# Altium schematic sheet 18 BATTERY CHARGER.SchDoc
size 513 x 386 mm
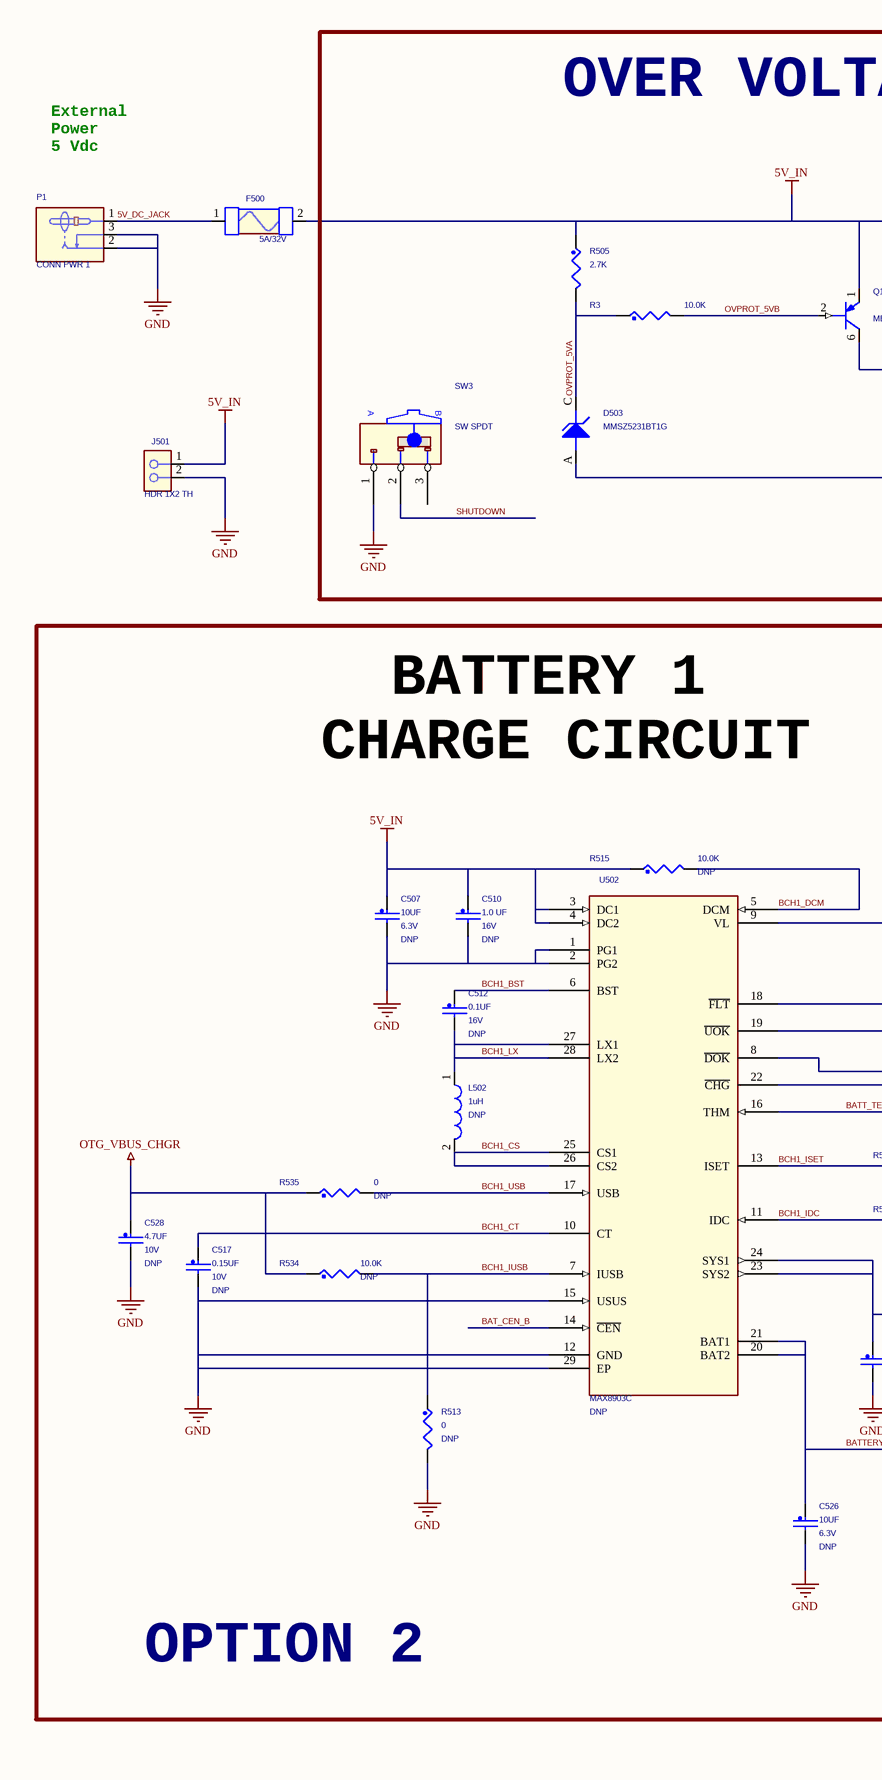
[diagram p0: 18 BATTERY CHARGER.SchDoc, left]
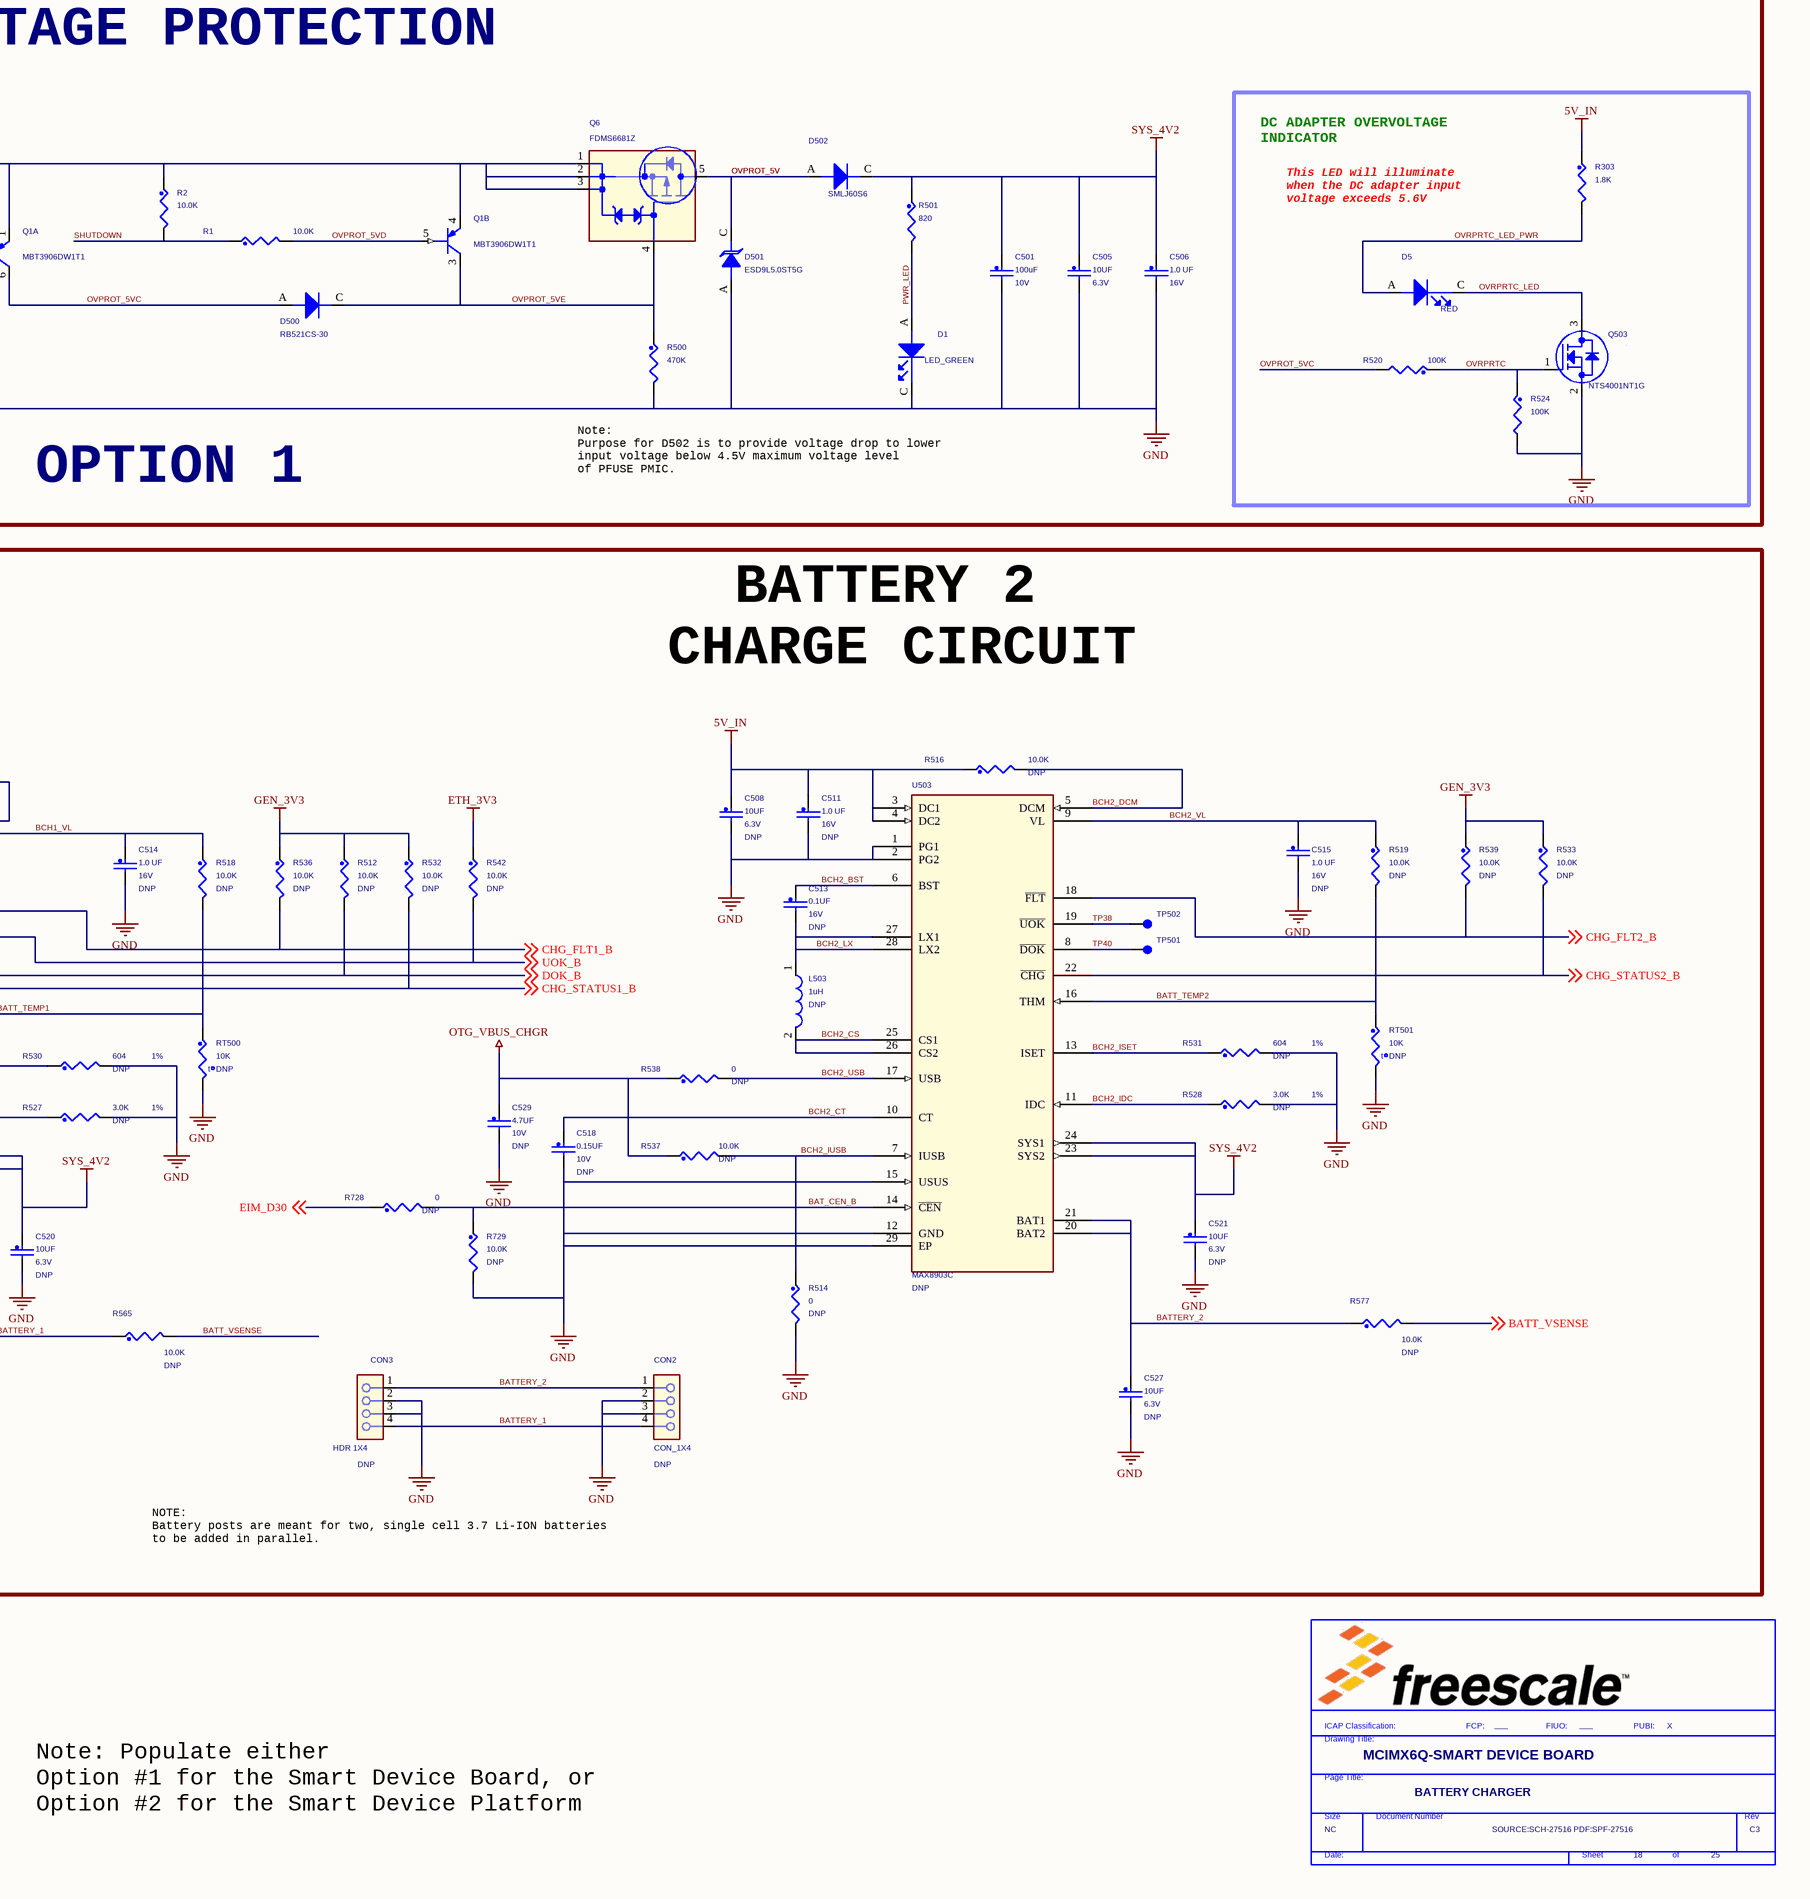
[diagram p1: 18 BATTERY CHARGER.SchDoc, right]

## Parts
*  FIUO: ___  PUBI: X  Doc: SOURCE:SCH-27516 PDF:SPF-27516  RevCode: C3  Title: MCIMX6Q-SMART DEVICE BOARD  Page Size: NC  Page Number: 18  Page Count: 25  PageTitle: BATTERY CHARGER  (hidden comment: TitleBlock_FS)  (graphical)
C501  100uF  WVDC: 10V  [1206_CC]
C505  10UF  WVDC: 6.3V  [0603_CC]
C506  1.0 UF  WVDC: 16V  [0603_CC]
C507  10UF  WVDC: 6.3V  ASSY_OPT: DNP  [0603_CC]
C508  10UF  WVDC: 6.3V  ASSY_OPT: DNP  [0603_CC]
C510  1.0 UF  WVDC: 16V  ASSY_OPT: DNP  [0603_CC]
C511  1.0 UF  WVDC: 16V  ASSY_OPT: DNP  [0603_CC]
C512  0.1UF  WVDC: 16V  ASSY_OPT: DNP  [0402_CC]
C513  0.1UF  WVDC: 16V  ASSY_OPT: DNP  [0402_CC]
C514  1.0 UF  WVDC: 16V  ASSY_OPT: DNP  [0603_CC]
C515  1.0 UF  WVDC: 16V  ASSY_OPT: DNP  [0603_CC]
C517  0.15UF  WVDC: 10V  ASSY_OPT: DNP  [0603_CC]
C518  0.15UF  WVDC: 10V  ASSY_OPT: DNP  [0603_CC]
C520  10UF  WVDC: 6.3V  ASSY_OPT: DNP  [0603_CC]
C521  10UF  WVDC: 6.3V  ASSY_OPT: DNP  [0603_CC]
C526  10UF  WVDC: 6.3V  ASSY_OPT: DNP  [0603_CC]
C527  10UF  WVDC: 6.3V  ASSY_OPT: DNP  [0603_CC]
C528  4.7UF  WVDC: 10V  ASSY_OPT: DNP  [0603_CC]
C529  4.7UF  WVDC: 10V  ASSY_OPT: DNP  [0603_CC]
CON2  CON_1X4  ASSY_OPT: DNP  [con_tb_4f_2p5_9x10p5]
CON3  HDR 1X4  ASSY_OPT: DNP  [HDR104]
D1  LED_GREEN  [LED_0603]
D5  RED  [LED_0603]
D500  RB521CS-30  [do_vmn2]
D501  ESD9L5.0ST5G  [sod-923]
D502  SMLJ60S6  [do214ab_sm]
D503  MMSZ5231BT1G  [sod123]
F500  5A/32V  [fuse_3p4x1p8]
J501  HDR 1X2 TH  [HDR102]
L502  1uH  ASSY_OPT: DNP  [ind_vls252010]
L503  1uH  ASSY_OPT: DNP  [ind_vls252010]
P1  CONN PWR 1  [PJ-202B]
Q1  MBT3906DW1T1  [sot363]  (parts A,B of 2)
Q6  FDMS6681Z  [POWER56]
Q503  NTS4001NT1G  [sc70_3]
R1  10.0K  [0402_CC]
R2  10.0K  [0402_CC]
R3  10.0K  [0402_CC]
R303  1.8K  [0402_CC]
R500  470K  [0603_CC]
R501  820  [0402_CC]
R505  2.7K  [0603_CC]
R512  10.0K  ASSY_OPT: DNP  [0402_CC]
R513  0  ASSY_OPT: DNP  [0402_CC]
R514  0  ASSY_OPT: DNP  [0402_CC]
R515  10.0K  ASSY_OPT: DNP  [0402_CC]
R516  10.0K  ASSY_OPT: DNP  [0402_CC]
R518  10.0K  ASSY_OPT: DNP  [0402_CC]
R519  10.0K  ASSY_OPT: DNP  [0402_CC]
R520  100K  [0402_CC]
R524  100K  [0402_CC]
R527  3.0K  Tolerance: 1%  ASSY_OPT: DNP  [0603_CC]
R528  3.0K  Tolerance: 1%  ASSY_OPT: DNP  [0603_CC]
R530  604  ASSY_OPT: DNP  Tolerance: 1%  [0603_CC]
R531  604  Tolerance: 1%  ASSY_OPT: DNP  [0603_CC]
R532  10.0K  ASSY_OPT: DNP  [0402_CC]
R533  10.0K  ASSY_OPT: DNP  [0402_CC]
R534  10.0K  ASSY_OPT: DNP  [0402_CC]
R535  0  ASSY_OPT: DNP  [0402_CC]
R536  10.0K  ASSY_OPT: DNP  [0402_CC]
R537  10.0K  ASSY_OPT: DNP  [0402_CC]
R538  0  ASSY_OPT: DNP  [0402_CC]
R539  10.0K  ASSY_OPT: DNP  [0402_CC]
R542  10.0K  ASSY_OPT: DNP  [0402_CC]
R565  10.0K  ASSY_OPT: DNP  [0402_CC]
R577  10.0K  ASSY_OPT: DNP  [0402_CC]
R728  0  ASSY_OPT: DNP  [0402_CC]
R729  10.0K  ASSY_OPT: DNP  [0402_CC]
RT500  10K  ASSY_OPT: DNP  [0603_CC]
RT501  10K  ASSY_OPT: DNP  [0603_CC]
SW3  SW SPDT  [sw_spdt_ra]
TP501  TEST POINT  [C035S]  (value not drawn)
TP502  TEST POINT  [C035S]  (value not drawn)
U502  MAX8903C  ASSY_OPT: DNP  [tqfn28_0p4_4x4]
U503  MAX8903C  ASSY_OPT: DNP  [tqfn28_0p4_4x4]

## Blocks framed on the sheet
OPTION 2: C507 C508 C510-C515 C517 C518 C520 C521 C526-C529 CON2 CON3 L502 L503 R512-R516 R518 R519 R527 R528 R530-R539 R542 R565 R577 R728 R729 RT500 RT501 TP501 TP502 U502 U503

## Nets
5V_IN: C507.1 C508.1 C510.1 C511.1 F500.2 J501.1 Q1.1(EMITTER) Q1.4(EMITTER) Q6.1(S1) Q6.2(S2) Q6.3(S3) R2.1 R303.1 R505.1 R515.1 R516.1 U502.3(DC1) U502.4(DC2) U503.3(DC1) U503.4(DC2)
ETH_3V3: R542.1
GEN_3V3: R512.1 R532.1 R533.1 R536.1 R539.1
GND: C501.2 C505.2 C506.2 C507.2 C508.2 C510.2 C511.2 C514.2 C515.2 C517.2 C518.2 C520.2 C521.2 C526.2 C527.2 C528.2 C529.2 CON2.2 CON2.3 CON3.2 CON3.3 D1.C(CATHODE) D501.A D503.A(ANODE) J501.2 P1.2 P1.3 Q503.2(SOURCE) R500.2 R513.2 R514.2 R524.2 R527.2 R528.2 R530.2 R531.2 R729.2 RT500.2 RT501.2 SW3.1(NO) U502.1(PG1) U502.2(PG2) U502.12(GND) U502.15(USUS) U502.29(EP) U503.1(PG1) U503.2(PG2) U503.12(GND) U503.15(USUS) U503.29(EP)
OTG_VBUS_CHGR: C528.1 C529.1 R534.1 R535.1 R537.1 R538.1
SYS_4V2: C501.1 C505.1 C506.1 C520.1 C521.1 D502.C(CATHODE) R501.1 U502.23(SYS2) U502.24(SYS1) U503.23(SYS2) U503.24(SYS1)
5V_DC_JACK: F500.1 P1.1(Pin)
BAT_CEN_B: R728.2 R729.1 U502.14(~{CEN}) U503.14(~{CEN})
BATT_TEMP1: R518.2 RT500.1 U502.16(THM)
BATT_TEMP2: R519.2 RT501.1 U503.16(THM)
BATT_VSENSE: R565.2 R577.2 ; off-sheet BATT_VSENSE
BATTERY_1: C526.1 CON2.4 CON3.4 R565.1 U502.20(BAT2) U502.21(BAT1)
BATTERY_2: C527.1 CON2.1 CON3.1 R577.1 U503.20(BAT2) U503.21(BAT1)
BCH1_BST: C512.1 U502.6(BST)
BCH1_CS: L502.2 U502.25(CS1) U502.26(CS2)
BCH1_CT: C517.1 U502.10(CT)
BCH1_DCM: R515.2 U502.5(DCM)
BCH1_IDC: R527.1 U502.11(IDC)
BCH1_ISET: R530.1 U502.13(ISET)
BCH1_IUSB: R513.1 R534.2 U502.7(IUSB)
BCH1_LX: C512.2 L502.1 U502.27(LX1) U502.28(LX2)
BCH1_USB: R535.2 U502.17(USB)
BCH1_VL: C514.1 R518.1 U502.9(VL)
BCH2_BST: C513.1 U503.6(BST)
BCH2_CS: L503.2 U503.25(CS1) U503.26(CS2)
BCH2_CT: C518.1 U503.10(CT)
BCH2_DCM: R516.2 U503.5(DCM)
BCH2_IDC: R528.1 U503.11(IDC)
BCH2_ISET: R531.1 U503.13(ISET)
BCH2_IUSB: R514.1 R537.2 U503.7(IUSB)
BCH2_LX: C513.2 L503.1 U503.27(LX1) U503.28(LX2)
BCH2_USB: R538.2 U503.17(USB)
BCH2_VL: C515.1 R519.1 U503.9(VL)
CHG_FLT1_B: R536.2 U502.18(~{FLT}) ; off-sheet CHG_FLT1_B
CHG_FLT2_B: R539.2 U503.18(~{FLT}) ; off-sheet CHG_FLT2_B
CHG_STATUS1_B: R532.2 U502.22(~{CHG}) ; off-sheet CHG_STATUS1_B
CHG_STATUS2_B: R533.2 U503.22(~{CHG}) ; off-sheet CHG_STATUS2_B
DOK_B: R512.2 U502.8(~{DOK}) ; off-sheet DOK_B
EIM_D30: R728.1 ; off-sheet EIM_D30
OVPROT_5V: D501.C D502.A(ANODE) Q6.5(D)
OVPROT_5VA: D503.C(CATHODE) R3.1 R505.2
OVPROT_5VB: Q1.2(BASE) R3.2
OVPROT_5VC: D500.A(ANODE) Q1.6(COLLECTOR) R520.2
OVPROT_5VD: Q1.5(BASE) R1.2
OVPROT_5VE: D500.C(CATHODE) Q1.3(COLLECTOR) Q6.4(G) R500.1
OVRPRTC: Q503.1(GATE) R520.1 R524.1
OVRPRTC_LED: D5.C(CATHODE) Q503.3(DRAIN)
OVRPRTC_LED_PWR: D5.A(ANODE) R303.2
PWR_LED: D1.A(ANODE) R501.2
SHUTDOWN: R1.1 R2.2 SW3.2(COM)
TP38: TP502.1(Pin1) U503.19(~{UOK})
TP40: TP501.1(Pin1) U503.8(~{DOK})
UOK_B: R542.2 U502.19(~{UOK}) ; off-sheet UOK_B

Not connected (* = marked no-connect by the designer): SW3 3(NC)

## Notes on the sheet
- External
  Power
  5 Vdc
- OVER VOLTAGE PROTECTION
- (near R303) DC ADAPTER OVERVOLTAGE
  INDICATOR
- (near R303) This LED will illuminate
  when the DC adapter input
  voltage exceeds 5.6V
- Note:
  Purpose for D502 is to provide voltage drop to lower
  input voltage below 4.5V maximum voltage level
  of PFUSE PMIC.
- OPTION 1
- BATTERY 2
  CHARGE CIRCUIT
- BATTERY 1
  CHARGE CIRCUIT
- NOTE:
  Battery posts are meant for two, single cell 3.7 Li-ION batteries
  to be added in parallel.
- Note: Populate either
  Option #1 for the Smart Device Board, or
  Option #2 for the Smart Device Platform
- (in symbol SW3_RA_SLIDE) A; B
- (in symbol THERMISTOR) t
- (in symbol TitleBlock_FS) ICAP Classification:; FCP:; FIUO:; PUBI:; Drawing Title:; Page Title:; Size; Document Number; Rev; Date:; Sheet; of

## Library data of the parts
* = TitleBlock_FS: OrgAddr2: Austin, TX 78735-8598; OrgAddr1: 6501 William Cannon Drive West; OrgName: Freescale Semiconductor; FCP: ___; Page Create Date: March  8, 1995
C501 = CAP_NP: CAP CER 100uF 10V 20% X5R 1206; CLASS: DISCRETE; AGILE_PN: 150-78880; MFG_NAME01: TDK; MFG_PN01: C3216X5R1A107M; CAD_APPROVED: Yes; FPLIST: CC1206_OV,CC1206,1206_CC; PRIORITY_PN: 021-00217; ROOM: DDR_PS; SIGNAL_MODEL: DEFAULT_CAPACITOR_1e+08pF_2_1; Tolerance: 20%; ROHS: Yes; HEIGHT: 1.9MM; VOLTAGE: 10V
C505 C507 C508 C520 C521 C527 = CAP_NP: CAP CER 10UF 6.3V 10% X5R 0603; CLASS: DISCRETE; AGILE_PN: 150-77832; MFG_NAME01: TDK; MFG_PN01: C1608X5R0J106KT; CAD_APPROVED: Yes; FPLIST: CC0603_OV,CC0603,0603_CC; SIGNAL_MODEL: DEFAULT_CAPACITOR_1e+07pF_2_1; Tolerance: 10%; ROHS: Yes; HEIGHT: 1.0MM; VOLTAGE: 6.3V
C506 C510 = CAP_NP: CAP CER 1.0UF 16V 10% X7R 0603; CLASS: DISCRETE; AGILE_PN: 150-30028; MFG_NAME01: AVX; MFG_PN01: 0603YC105KAT2A; CAD_APPROVED: Yes; FPLIST: CC0603_OV,CC0603,0603_CC; SIGNAL_MODEL: DEFAULT_CAPACITOR_1e+06pF_2_1; Tolerance: 10%; ROHS: Yes; HEIGHT: 1.0MM; VOLTAGE: 16V
C511 C514 C515 = CAP_NP: CAP CER 1.0UF 16V 10% X7R 0603; CLASS: DISCRETE; FPLIST: CC0603_OV,CC0603,0603_CC; CAD_APPROVED: Yes; MFG_PN01: 0603YC105KAT2A; MFG_NAME01: AVX; AGILE_PN: 150-30028; SIGNAL_MODEL: DEFAULT_CAPACITOR_1e+06pF_2_1; HEIGHT: 1.0MM; ROHS: Yes; Tolerance: 10%; VOLTAGE: 16V
C512 = CAP_NP: CAP CER 0.1UF 16V 10% X7R 0402; CLASS: DISCRETE; SIGNAL_MODEL: DEFAULT_CAPACITOR_100000pF_2_1; FPLIST: CC0402_25,CC0402_HD,0402_CC; CAD_APPROVED: Yes; MFG_PN01: C0402C104K4RAC; MFG_NAME01: KEMET; AGILE_PN: 150-75182; HEIGHT: 0.635MM; ROHS: Yes; Tolerance: 10%; VOLTAGE: 16V
C513 = CAP_NP: CAP CER 0.1UF 16V 10% X7R 0402; CLASS: DISCRETE; FPLIST: CC0402_25,CC0402_HD,0402_CC; CAD_APPROVED: Yes; MFG_PN01: C0402C104K4RAC; MFG_NAME01: KEMET; AGILE_PN: 150-75182; SIGNAL_MODEL: DEFAULT_CAPACITOR_100000pF_2_1; HEIGHT: 0.635MM; ROHS: Yes; Tolerance: 10%; VOLTAGE: 16V
C517 C518 = CAP_NP: CAP CER 0.15UF 10V 10% X7R 0603; CLASS: DISCRETE; AGILE_PN: 150-75196; MFG_NAME01: VENKEL COMPANY; MFG_PN01: C0603X7R100-154KNE; CAD_APPROVED: Yes; FPLIST: CC0603_OV,CC0603,0603_CC; SIGNAL_MODEL: DEFAULT_CAPACITOR_150000pF_2_1; Tolerance: 10%; ROHS: Yes; HEIGHT: 0.9652 MM; VOLTAGE: 10V
C526 = CAP_NP: CAP CER 10UF 6.3V 10% X5R 0603; CLASS: DISCRETE; FPLIST: CC0603_OV,CC0603,0603_CC; CAD_APPROVED: Yes; MFG_PN01: C1608X5R0J106KT; MFG_NAME01: TDK; AGILE_PN: 150-77832; SIGNAL_MODEL: DEFAULT_CAPACITOR_1e+07pF_2_1; HEIGHT: 1.0MM; ROHS: Yes; Tolerance: 10%; VOLTAGE: 6.3V
C528 C529 = CAP_NP: CAP CER 4.7UF 10V 10% X5R 0603; CLASS: DISCRETE; AGILE_PN: 150-77975; MFG_NAME01: TAIYO YUDEN; MFG_PN01: LMK107BJ475KA-T; CAD_APPROVED: Yes; FPLIST: CC0603_OV,CC0603,0603_CC; SIGNAL_MODEL: DEFAULT_CAPACITOR_4.7e+06pF_2_1; Tolerance: 10%; ROHS: Yes; HEIGHT: 0.9MM; VOLTAGE: 10V
CON2 = CONN_HDR_4X1: CON 1X4 TB SKT SPRING CLIP SMT 2.5MM SP 197H --; CLASS: IO; AGILE_PN: 211-79178; MFG_NAME01: PHOENIX CONTACT; MFG_PN01: 1702474; CAD_APPROVED: Yes; ROHS: Yes; HEIGHT: 5MM
CON3 = CONN_HDR_4X1: HDR 1X4 TH 100MIL SP 395H SN 110L; CLASS: IO; AGILE_PN: 210-78427; MFG_NAME01: TYCO ELECTRONICS; MFG_PN01: 3-644456-4; CAD_APPROVED: Yes; ROHS: Yes; HEIGHT: 10.29MM
D1 = LED: LED ULTRA-BRIGHT GREEN SMT 0603; CLASS: IC; CAD_APPROVED: YES; MFG_PN01: LTST-C190KGKT; MFG_NAME01: LITE ON; AGILE_PN: 370-75077; HEIGHT: 0.8MM; ROHS: Yes
D5 = LED: LED ULTRA BRIGHT RED SGL 30MA 0603; CLASS: IC; CAD_APPROVED: Yes; MFG_PN01: LTST-C190KRKT; MFG_NAME01: LITE ON; AGILE_PN: 370-75079; HEIGHT: 0.9MM; ROHS: Yes
D500 = DIODE: DIODE SCH SS 100MA 30V VMN2; CLASS: IC; AGILE_PN: 480-77936; MFG_NAME01: ROHM; MFG_PN01: RB521CS-30T2R; CAD_APPROVED: Yes; ROHS: Yes; HEIGHT: 0.4MM
D501 = DIODE_TVS: DIODE TVS ESD PROT ULT LOW CAP 5-5.4V SOD-923; CLASS: IC; AGILE_PN: 480-77934; MFG_NAME01: ON SEMICONDUCTOR; CAD_APPROVED: Yes; MFG_PN01: ESD9L5.0ST5G; ROHS: Yes; HEIGHT: 0.40MM
D502 = DIODE: DIODE RECT 6.0A 600V DO-214AB; CLASS: IC; AGILE_PN: 480-78262; MFG_NAME01: MICRO COMMERCIAL COMPONENTS CORP; MFG_PN01: SMLJ60S6-TP; CAD_APPROVED: Yes; ROHS: Yes; HEIGHT: 2.82MM
D503 = ZDIODE: DIODE ZNR 5.1V 0.5W SOD123; CLASS: IC; AGILE_PN: 480-76885; MFG_NAME01: ON SEMICONDUCTOR; CAD_APPROVED: Yes; MFG_PN01: MMSZ5231BT1G; ROHS: Yes; HEIGHT: 1.35MM
F500 = FUSE: FUSE FAST 5A 32V SMT; CLASS: IC; CAD_APPROVED: Yes; MFG_PN01: 3216FF5-R; MFG_NAME01: COOPER BUSSMANN; AGILE_PN: 510-77398; HEIGHT: 1.09MM; ROHS: Yes
J501 = CONN_HDR_2X1: HDR 1X2 TH 100MIL SP 339H AU 98L; CLASS: IO; CAD_APPROVED: YES; MFG_PN01: TSW-102-07-G-S; MFG_NAME01: SAMTEC; AGILE_PN: 210-75439; HEIGHT: 8.71 MM; ROHS: Yes
L502 L503 = INDUCTOR: IND PWR 1UH@1MHZ 2A 30% SMT; PART_TYPE: INDUCTOR\POWER; CLASS: DISCRETE; CAD_APPROVED: Yes; MFG_PN01: VLS252010T-1R0N; MFG_NAME01: TDK; AGILE_PN: 180-77708; SIGNAL_MODEL: DEFAULT_INDUCTOR_1000nH_2_1; HEIGHT: 1.0 MM; ROHS: Yes; Tolerance: 30%
P1 = DC POWER JACK: CON 1 PWR PLUG DIAM 2.0MM RA TH HIGH CURRENT-- 430H NI 140L; CLASS: IO; CAD_APPROVED: Yes; MFG_PN01: PJ-202AH; MFG_NAME01: CUI STACK; AGILE_PN: 210-79447; HEIGHT: 11.2MM; ROHS: Yes
Q1 = PNP_DUAL: TRAN PNP GEN DUAL 200MA 40V SOT363; CLASS: IC; AGILE_PN: 480-77930; MFG_NAME01: ON SEMICONDUCTOR; MFG_PN01: MBT3906DW1T1G; CAD_APPROVED: Yes; ROHS: Yes; HEIGHT: 1.1MM
Q6 = FDMS6681Z: TRAN PMOS PWR 49A 30V POWER56; CLASS: IC; AGILE_PN: 480-77938; MFG_NAME01: FAIRCHILD; CAD_APPROVED: Yes; MFG_PN01: FDMS6681Z; ROHS: Yes; HEIGHT: 1.10MM
Q503 = MOSFET_N: TRAN NMOS SW 30V 270MA SC-70; CLASS: IC; CAD_APPROVED: Yes; MFG_NAME01: ON SEMICONDUCTOR; AGILE_PN: 480-76278; HEIGHT: 1.0MM; ROHS: Yes; MFG_PN01: NTS4001NT1G
R1 = RES: RES MF 10.0K 1/16W 1% 0402; CLASS: DISCRETE; SIGNAL_MODEL: DEFAULT_RESISTOR_10000OHM_2_1; FPLIST: RC0402_25,RC0402_HD,0402_CC; CAD_APPROVED: Yes; MFG_PN01: CRCW040210K0FKED; MFG_NAME01: VISHAY INTERTECHNOLOGY; AGILE_PN: 470-75416; ROHS: Yes; Tolerance: 1%
R2 R3 = RES: RES MF 10.0K 1/16W 1% 0402; CLASS: DISCRETE; SIGNAL_MODEL: DEFAULT_RESISTOR_10000OHM_2_1; AGILE_PN: 470-75416; MFG_NAME01: VISHAY INTERTECHNOLOGY; MFG_PN01: CRCW040210K0FKED; CAD_APPROVED: Yes; FPLIST: RC0402_25,RC0402_HD,0402_CC; Tolerance: 1%; ROHS: Yes
R303 = RES: RES MF 1.8K 1/16W 5% 0402; CLASS: DISCRETE; AGILE_PN: 470-75640; MFG_NAME01: BOURNS; MFG_PN01: CR0402-JW-182GLF; CAD_APPROVED: Yes; FPLIST: RC0402_25,RC0402_HD,0402_CC; SIGNAL_MODEL: DEFAULT_RESISTOR_1800OHM_2_1; TOL: 5%; ROHS: Yes; HEIGHT: 0.4mm; Tolerance: 5%
R500 = RES: RES MF 470K 1/10W 5% 0603; CLASS: DISCRETE; SIGNAL_MODEL: DEFAULT_RESISTOR_470000OHM_2_1; FPLIST: RC0603_OV,RC0603,0603_CC; CAD_APPROVED: Yes; MFG_PN01: CR0603-JW-474ELF; MFG_NAME01: BOURNS; AGILE_PN: 470-75455; ROHS: Yes; Tolerance: 5%
R501 = RES: RES MF 820 OHM 1/10W 5% 0402; CLASS: DISCRETE; AGILE_PN: 470-79260; MFG_NAME01: PANASONIC; MFG_PN01: ERJ2GEJ821X; CAD_APPROVED: Yes; FPLIST: RC0402_25,RC0402_HD,0402_CC; SIGNAL_MODEL: DEFAULT_RESISTOR_820OHM_2_1; Tolerance: 5%; ROHS: Yes
R505 = RES: RES MF 2.7K 1/10W 5% 0603; CLASS: DISCRETE; SIGNAL_MODEL: DEFAULT_RESISTOR_2700OHM_2_1; AGILE_PN: 470-75910; MFG_NAME01: KOA SPEER; MFG_PN01: RK73B1JTTD272J; CAD_APPROVED: Yes; FPLIST: RC0603_OV,RC0603,0603_CC; Tolerance: 5%; ROHS: Yes
R512 R533 R534 R536 R537 R565 R577 = RES: RES MF 10.0K 1/16W 1% 0402; CLASS: DISCRETE; AGILE_PN: 470-75416; MFG_NAME01: VISHAY INTERTECHNOLOGY; MFG_PN01: CRCW040210K0FKED; CAD_APPROVED: Yes; FPLIST: RC0402_25,RC0402_HD,0402_CC; SIGNAL_MODEL: DEFAULT_RESISTOR_10000OHM_2_1; Tolerance: 1%; ROHS: Yes
R513 R514 R535 R538 = RES: RES MF ZERO OHM 1/10W -- 0402; CLASS: DISCRETE; FPLIST: RC0402_25,RC0402_HD,RC0402_X2,0402_CC; CAD_APPROVED: Yes; MFG_PN01: ERJ-2GE0R00X; MFG_NAME01: Panasonic; AGILE_PN: 470-79965; SIGNAL_MODEL: DEFAULT_RESISTOR_0.001OHM_2_1; ROHS: Yes
R515 R516 R518 R519 R532 R539 R542 R729 = RES: RES MF 10.0K 1/16W 1% 0402; CLASS: DISCRETE; FPLIST: RC0402_25,RC0402_HD,0402_CC; CAD_APPROVED: Yes; MFG_PN01: CRCW040210K0FKED; MFG_NAME01: VISHAY INTERTECHNOLOGY; AGILE_PN: 470-75416; SIGNAL_MODEL: DEFAULT_RESISTOR_10000OHM_2_1; ROHS: Yes; Tolerance: 1%
R520 = RES: RES MF 100K 1/16W 1% 0402; CLASS: DISCRETE; SIGNAL_MODEL: DEFAULT_RESISTOR_100000OHM_2_1; AGILE_PN: 470-76240; MFG_NAME01: KOA SPEER; MFG_PN01: RK73H1ETTP1003F; CAD_APPROVED: Yes; FPLIST: RC0402_25,RC0402_HD,0402_CC; Tolerance: 1%; ROHS: Yes
R524 = RES: RES MF 100K 1/16W 1% 0402; CLASS: DISCRETE; SIGNAL_MODEL: DEFAULT_RESISTOR_100000OHM_2_1; FPLIST: RC0402_25,RC0402_HD,0402_CC; CAD_APPROVED: Yes; MFG_PN01: RK73H1ETTP1003F; MFG_NAME01: KOA SPEER; AGILE_PN: 470-76240; ROHS: Yes; Tolerance: 1%
R527 R528 = RES: RES MF 3.0K 1/10W 1% 0603; CLASS: DISCRETE; AGILE_PN: 470-78009; MFG_NAME01: KOA SPEER; MFG_PN01: RK73H1JTTD3001F; CAD_APPROVED: Yes; FPLIST: RC0603_OV,RC0603,0603_CC; SIGNAL_MODEL: DEFAULT_RESISTOR_3000OHM_2_1; ROHS: Yes
R530 = RES: RES MF 604 OHM  1/10W 1% 0603; CLASS: DISCRETE; FPLIST: RC0603_OV,RC0603,0603_CC; CAD_APPROVED: Yes; MFG_PN01: RK73H1JTTD6040F; MFG_NAME01: KOA SPEER; AGILE_PN: 470-77959; SIGNAL_MODEL: DEFAULT_RESISTOR_604OHM_2_1; ROHS: Yes
R531 = RES: RES MF 604 OHM  1/10W 1% 0603; CLASS: DISCRETE; AGILE_PN: 470-77959; MFG_NAME01: KOA SPEER; MFG_PN01: RK73H1JTTD6040F; CAD_APPROVED: Yes; FPLIST: RC0603_OV,RC0603,0603_CC; SIGNAL_MODEL: DEFAULT_RESISTOR_604OHM_2_1; ROHS: Yes
R728 = RES: RES MF ZERO OHM 1/10W -- 0402; CLASS: DISCRETE; SIGNAL_MODEL: DEFAULT_RESISTOR_0.001OHM_2_1; AGILE_PN: 470-79965; MFG_NAME01: Panasonic; MFG_PN01: ERJ-2GE0R00X; CAD_APPROVED: Yes; FPLIST: RC0402_25,RC0402_HD,RC0402_X2,0402_CC; ROHS: Yes
RT500 RT501 = THERMISTOR: THERMISTOR 10K 1/10W 1% 0603; CLASS: DISCRETE; AGILE_PN: 470-80022; MFG_NAME01: MuRata; MFG_PN01: NCP18XH103F03RB; CAD_APPROVED: Yes; FPLIST: RC0603_OV,RC0603,0603_CC; SIGNAL_MODEL: DEFAULT_RESISTOR_10000OHM_2_1; Tolerance: 1%; ROHS: Yes
SW3 = SW3_RA_SLIDE: SW SPDT CNTR SMT SLD 6V 0.3A --; CLASS: IC; AGILE_PN: 510-75010-00; MFG_NAME01: ITT CANNON; MFG_PN01: PCM12SMTR; CAD_APPROVED: Yes; ROHS: Yes; HEIGHT: 1.4MM
TP501 TP502 = Test pad: TEST POINT PAD 35 MIL SMT, NO PART TO ORDER; CLASS: IC; CAD_APPROVED: Yes; ASSY_OPT: DNP; MFG_PN01: NA; AGILE_PN: 280-75148; HEIGHT: 0.1 MM; ROHS: Yes; MFG_NAME01: NA
U502 = MAX8903A_TQFN_28P: IC DCDC CHARGER LI+ 2A 4.15-16V TQFN28; AGILE_PN: 312-80588; MFG_NAME01: MAXIM; MFG_PN01: MAX8903CETI+; CAD_APPROVED: Yes; CLASS: IC; ROHS: Yes; HEIGHT: 0.8MM
U503 = MAX8903A_TQFN_28P: IC DCDC CHARGER LI+ 2A 4.15-16V TQFN28; CAD_APPROVED: Yes; MFG_PN01: MAX8903CETI+; MFG_NAME01: MAXIM; AGILE_PN: 312-80588; CLASS: IC; HEIGHT: 0.8MM; ROHS: Yes